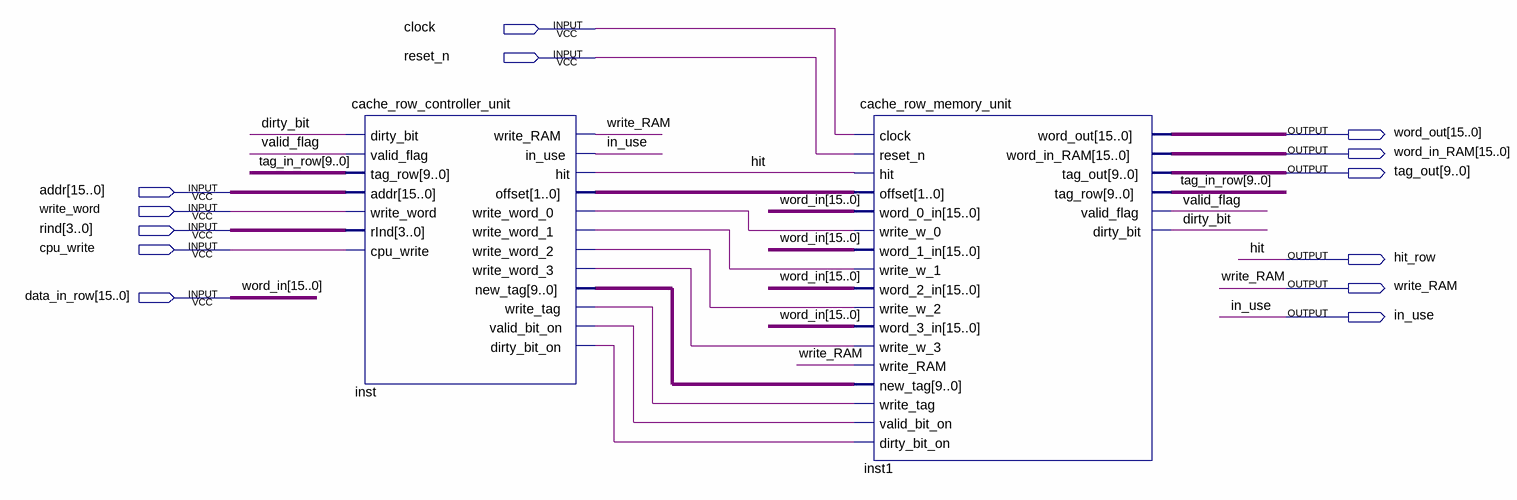
[diagram p0: schematic sheet]
// Quartus schematic cache_row_unit.bdf as structural Verilog: 2 symbols, 13 pins
module cache_row_unit (
  input  clock,
  input  reset_n,
  input  [15:0] addr,
  input  write_word,
  input  [3:0] rind,
  input  cpu_write,
  input  [15:0] data_in_row,
  output [15:0] word_out,
  output [15:0] word_in_RAM,
  output [9:0] tag_out,
  output hit_row,
  output write_RAM,
  output in_use
);

  wire dirty_bit, inst_dirty_bit_on, inst_valid_bit_on, inst_write_tag, inst_write_word_0, inst_write_word_1,
       inst_write_word_2, inst_write_word_3, valid_flag;
  wire [1:0] inst_offset;
  wire [9:0] inst_new_tag, tag_in_row;

  cache_row_controller_unit inst (
    .dirty_bit(dirty_bit), .valid_flag(valid_flag), .tag_row(tag_in_row), .addr(addr),
    .write_word(write_word), .rInd(rind), .cpu_write(cpu_write), .write_RAM(write_RAM), .in_use(in_use),
    .hit(hit_row), .offset(inst_offset), .write_word_0(inst_write_word_0), .write_word_1(inst_write_word_1),
    .write_word_2(inst_write_word_2), .write_word_3(inst_write_word_3), .new_tag(inst_new_tag),
    .write_tag(inst_write_tag), .valid_bit_on(inst_valid_bit_on), .dirty_bit_on(inst_dirty_bit_on));
  cache_row_memory_unit inst1 (
    .clock(clock), .reset_n(reset_n), .hit(hit_row), .offset(inst_offset), .word_0_in(data_in_row),
    .write_w_0(inst_write_word_0), .word_1_in(data_in_row), .write_w_1(inst_write_word_1),
    .word_2_in(data_in_row), .write_w_2(inst_write_word_2), .word_3_in(data_in_row),
    .write_w_3(inst_write_word_3), .write_RAM(write_RAM), .new_tag(inst_new_tag), .write_tag(inst_write_tag),
    .valid_bit_on(inst_valid_bit_on), .dirty_bit_on(inst_dirty_bit_on), .word_out(word_out),
    .word_in_RAM(word_in_RAM), .tag_out(tag_out), .tag_row(tag_in_row), .valid_flag(valid_flag),
    .dirty_bit(dirty_bit));

  // Other names for the same wires on the sheet: hit = hit_row; word_in[15:0] = data_in_row
endmodule
